# Altium project mgtf.PrjPCB
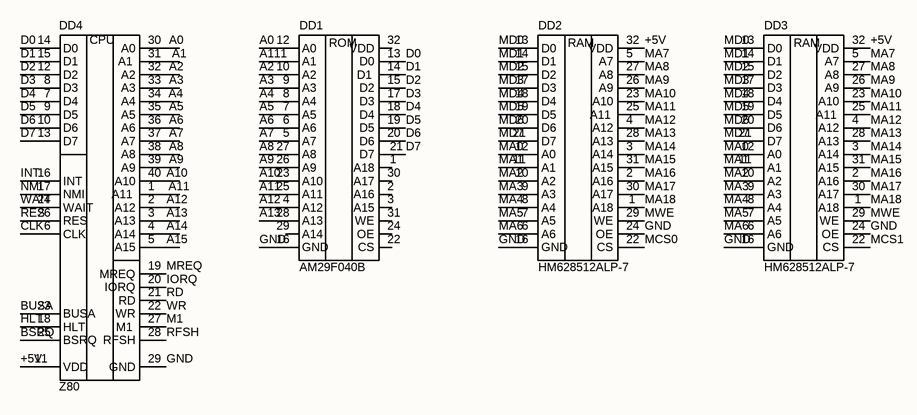
[diagram p0: main.SchDoc]
2 sheets, 10 parts. Net scope: global (net labels, ports and power ports of the same name join across sheets).
Board file: pcb.PcbDoc
Sheets:
  main.SchDoc
  connectors.SchDoc

## Sheet main.SchDoc
size 209 x 297 mm; Address1: Address1; Address2: Address2; Address3: Address3; Address4: Address4; SheetNumber: 1; SheetTotal: 1; Scale: 1:1; Разраб.: Михаил Каа; Обозначение документа: МГТФ.001 Э3; Пров.: no check; Утв.: chat; Номер листа: 1; Общее количество листов: 1; Наименование организации: Михаил Каа; Перв. применение: МГТФ.001; Наименование изделия 1: МГТФ; Наименование изделия 2: Схема электрическая; Наименование изделия 3: принципиальная; Нач. отд.: Нач. отд.; Фамилия нач. отд.: chat

### Parts
DD1  AM29F040B  [DIP254P1524X482-32]
DD2  HM628512ALP-7  [DIP254P1524X482-32]
DD3  HM628512ALP-7  [DIP254P1524X482-32]
DD4  Z80  [DIP1540W47P254L5320H635Q40B]

### Nets
+5V: DD2.32(VDD) DD3.32(VDD) DD4.11(VDD)
A0: DD1.12(A0) DD4.30(A0)
A1: DD1.11(A1) DD4.31(A1)
A2: DD1.10(A2) DD4.32(A2)
A3: DD1.9(A3) DD4.33(A3)
A4: DD1.8(A4) DD4.34(A4)
A5: DD1.7(A5) DD4.35(A5)
A6: DD1.6(A6) DD4.36(A6)
A7: DD1.5(A7) DD4.37(A7)
A8: DD1.27(A8) DD4.38(A8)
A9: DD1.26(A9) DD4.39(A9)
A10: DD1.23(A10) DD4.40(A10)
A11: DD1.25(A11) DD4.1(A11)
A12: DD1.4(A12) DD4.2(A12)
A13: DD1.28(A13) DD4.3(A13)
A14: DD4.4(A14)
A15: DD4.5(A15)
BSRQ: DD4.25(BSRQ)
BUSA: DD4.23(BUSA)
CLK: DD4.6(CLK)
D0: DD1.13(D0) DD4.14(D0)
D1: DD1.14(D1) DD4.15(D1)
D2: DD1.15(D2) DD4.12(D2)
D3: DD1.17(D3) DD4.8(D3)
D4: DD1.18(D4) DD4.7(D4)
D5: DD1.19(D5) DD4.9(D5)
D6: DD1.20(D6) DD4.10(D6)
D7: DD1.21(D7) DD4.13(D7)
GND: DD1.16(GND) DD2.16(GND) DD2.24(OE) DD3.16(GND) DD3.24(OE) DD4.29(GND)
HLT: DD4.18(HLT)
INT: DD4.16(INT)
IORQ: DD4.20(IORQ)
M1: DD4.27(M1)
MA0: DD2.12(A0) DD3.12(A0)
MA1: DD2.11(A1) DD3.11(A1)
MA2: DD2.10(A2) DD3.10(A2)
MA3: DD2.9(A3) DD3.9(A3)
MA4: DD2.8(A4) DD3.8(A4)
MA5: DD2.7(A5) DD3.7(A5)
MA6: DD2.6(A6) DD3.6(A6)
MA7: DD2.5(A7) DD3.5(A7)
MA8: DD2.27(A8) DD3.27(A8)
MA9: DD2.26(A9) DD3.26(A9)
MA10: DD2.23(A10) DD3.23(A10)
MA11: DD2.25(A11) DD3.25(A11)
MA12: DD2.4(A12) DD3.4(A12)
MA13: DD2.28(A13) DD3.28(A13)
MA14: DD2.3(A14) DD3.3(A14)
MA15: DD2.31(A15) DD3.31(A15)
MA16: DD2.2(A16) DD3.2(A16)
MA17: DD2.30(A17) DD3.30(A17)
MA18: DD2.1(A18) DD3.1(A18)
MCS0: DD2.22(CS)
MCS1: DD3.22(CS)
MD0: DD2.13(D0) DD3.13(D0)
MD1: DD2.14(D1) DD3.14(D1)
MD2: DD2.15(D2) DD3.15(D2)
MD3: DD2.17(D3) DD3.17(D3)
MD4: DD2.18(D4) DD3.18(D4)
MD5: DD2.19(D5) DD3.19(D5)
MD6: DD2.20(D6) DD3.20(D6)
MD7: DD2.21(D7) DD3.21(D7)
MREQ: DD4.19(MREQ)
MWE: DD2.29(WE) DD3.29(WE)
NMI: DD4.17(NMI)
RD: DD4.21(RD)
RES: DD4.26(RES)
RFSH: DD4.28(RFSH)
WAIT: DD4.24(WAIT)
WR: DD4.22(WR)

Not connected (* = marked no-connect by the designer): DD1 1(A18) 2(A16) 3(A15) 22(CS) 24(OE) 29(A14) 30(A17) 31(WE) 32(VDD)

### Notes on the sheet
- Перв. примен.
- Справ. №
- Подп. и дата
- Инв. № дубл.
- Взам. инв. №
- Разраб.
- Изм.
- Лист
- № докум.
- Подп.
- Дата
- Лит.
- Масса
- Масштаб
- Пров.
- Т.контр.
- Листов
- Инв. № подл.
- Утв.
- Н.контр.
- Копировал
- Формат А4
- (in symbol AM29F040B) ROM
- (in symbol HM628512ALP-7) RAM
- (in symbol Z80) CPU

### Library data of the parts
DD2 DD3 = HM628512ALP-7: 512Kx8 Static RAM

## Sheet connectors.SchDoc
size 209 x 297 mm; Address1: Address1; Address2: Address2; Address3: Address3; Address4: Address4; SheetNumber: 1; SheetTotal: 1; Scale: 1:1; Разраб.: Михаил Каа; Обозначение документа: МГТФ.001 Э3; Пров.: no check; Утв.: chat; Номер листа: 1; Общее количество листов: 1; Наименование организации: Михаил Каа; Перв. применение: МГТФ.001; Наименование изделия 1: МГТФ; Наименование изделия 2: Схема электрическая; Наименование изделия 3: принципиальная; Нач. отд.: Нач. отд.; Фамилия нач. отд.: chat
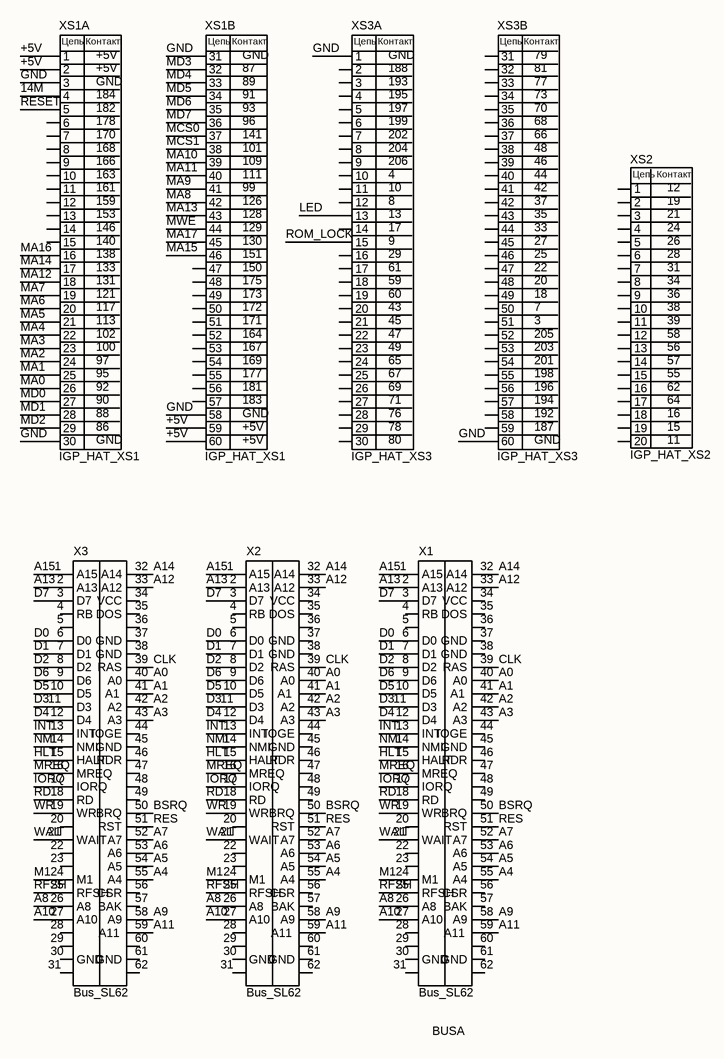
[diagram p1: connectors.SchDoc]

### Parts
X1  Bus_SL62  [SL62]
X2  Bus_SL62  [SL62]
X3  Bus_SL62  [SL62]
XS1  IGP_HAT_XS1  [IGP_HAT_XS_60PIN]  (parts A,B of 2)
XS2  IGP_HAT_XS2  [IGP_HAT_XS_20PIN]
XS3  IGP_HAT_XS3  [IGP_HAT_XS_60PIN]  (parts A,B of 2)

### Nets
14M: XS1.4
+5V: XS1.1 XS1.2 XS1.59 XS1.60
A0: X1.40(A0) X2.40(A0) X3.40(A0)
A1: X1.41(A1) X2.41(A1) X3.41(A1)
A2: X1.42(A2) X2.42(A2) X3.42(A2)
A3: X1.43(A3) X2.43(A3) X3.43(A3)
A4: X1.55(A4) X2.55(A4) X3.55(A4)
A5: X1.54(A5) X2.54(A5) X3.54(A5)
A6: X1.53(A6) X2.53(A6) X3.53(A6)
A7: X1.52(A7) X2.52(A7) X3.52(A7)
A8: X1.26(A8) X2.26(A8) X3.26(A8)
A9: X1.58(A9) X2.58(A9) X3.58(A9)
A10: X1.27(A10) X2.27(A10) X3.27(A10)
A11: X1.59(A11) X2.59(A11) X3.59(A11)
A12: X1.33(A12) X2.33(A12) X3.33(A12)
A13: X1.2(A13) X2.2(A13) X3.2(A13)
A14: X1.32(A14) X2.32(A14) X3.32(A14)
A15: X1.1(A15) X2.1(A15) X3.1(A15)
BSRQ: X1.50(BRQ) X2.50(BRQ) X3.50(BRQ)
CLK: X1.39(RAS) X2.39(RAS) X3.39(RAS)
D0: X1.6(D0) X2.6(D0) X3.6(D0)
D1: X1.7(D1) X2.7(D1) X3.7(D1)
D2: X1.8(D2) X2.8(D2) X3.8(D2)
D3: X1.11(D3) X2.11(D3) X3.11(D3)
D4: X1.12(D4) X2.12(D4) X3.12(D4)
D5: X1.10(D5) X2.10(D5) X3.10(D5)
D6: X1.9(D6) X2.9(D6) X3.9(D6)
D7: X1.3(D7) X2.3(D7) X3.3(D7)
GND: XS1.3 XS1.30 XS1.31 XS1.58 XS3.1 XS3.60
HLT: X1.15(HALT) X2.15(HALT) X3.15(HALT)
INT: X1.13(INT) X2.13(INT) X3.13(INT)
IORQ: X1.17(IORQ) X2.17(IORQ) X3.17(IORQ)
LED: XS3.13
M1: X1.24(M1) X2.24(M1) X3.24(M1)
MA0: XS1.26
MA1: XS1.25
MA2: XS1.24
MA3: XS1.23
MA4: XS1.22
MA5: XS1.21
MA6: XS1.20
MA7: XS1.19
MA8: XS1.42
MA9: XS1.41
MA10: XS1.39
MA11: XS1.40
MA12: XS1.18
MA13: XS1.43
MA14: XS1.17
MA15: XS1.46
MA16: XS1.16
MA17: XS1.45
MCS0: XS1.37
MCS1: XS1.38
MD0: XS1.27
MD1: XS1.28
MD2: XS1.29
MD3: XS1.32
MD4: XS1.33
MD5: XS1.34
MD6: XS1.35
MD7: XS1.36
MREQ: X1.16(MREQ) X2.16(MREQ) X3.16(MREQ)
MWE: XS1.44
NMI: X1.14(NMI) X2.14(NMI) X3.14(NMI)
RD: X1.18(RD) X2.18(RD) X3.18(RD)
RES: X1.51(RST) X2.51(RST) X3.51(RST)
RESET: XS1.5
RFSH: X1.25(RFSH) X2.25(RFSH) X3.25(RFSH)
ROM_LOCK: XS3.15
WAIT: X1.21(WAIT) X2.21(WAIT) X3.21(WAIT)
WR: X1.19(WR) X2.19(WR) X3.19(WR)

Not connected (* = marked no-connect by the designer): X1 4(RB) 5 20 22 23 28 29 30(GND) 31 34(VCC) 35(DOS) 36 37(GND) 38(GND) 44(IOGE) 45(GND) 46(RDR) 47 48 49 56(CSR) 57(BAK) 60 61(GND) 62; X2 4(RB) 5 20 22 23 28 29 30(GND) 31 34(VCC) 35(DOS) 36 37(GND) 38(GND) 44(IOGE) 45(GND) 46(RDR) 47 48 49 56(CSR) 57(BAK) 60 61(GND) 62; X3 4(RB) 5 20 22 23 28 29 30(GND) 31 34(VCC) 35(DOS) 36 37(GND) 38(GND) 44(IOGE) 45(GND) 46(RDR) 47 48 49 56(CSR) 57(BAK) 60 61(GND) 62; XS1 6 7 8 9 10 11 12 13 14 15 47 48 49 50 51 52 53 54 55 56 57; XS2 1 2 3 4 5 6 7 8 9 10 11 12 13 14 15 16 17 18 19 20; XS3 2 3 4 5 6 7 8 9 10 11 12 14 16 17 18 19 20 21 22 23 24 25 26 27 28 29 30 31 32 33 34 35 36 37 38 39 40 41 42 43 44 45 46 47 48 49 50 51 52 53 54 55 56 57 58 59

### Notes on the sheet
- Labels drawn without touching a wire or pin: BUSA
- Подп. и дата
- Инв. № дубл.
- Взам. инв. №
- Инв. № подл.
- Изм.
- Лист
- № докум.
- Подп.
- Дата
- Копировал
- Формат А4
- (in symbol IGP_HAT_XS1, part A) Цепь; Контакт; +5V; GND; 184; 182; 178; 170; 168; 166; 163; 161; 159; 153; 146; 140; 138; 133; 131; 121; 117; 113; 102; 100; 97; 95; 92; 90; 88; 86
- (in symbol IGP_HAT_XS1, part B) Цепь; Контакт; GND; 87; 89; 91; 93; 96; 141; 101; 109; 111; 99; 126; 128; 129; 130; 151; 150; 175; 173; 172; 171; 164; 167; 169; 177; 181; 183; +5V
- (in symbol IGP_HAT_XS2) Цепь; Контакт; 21; 24; 26; 28; 31; 34; 36; 38; 39; 58; 56; 57; 55; 62; 64
- (in symbol IGP_HAT_XS3, part A) Цепь; Контакт; GND; 188; 193; 195; 197; 199; 202; 204; 206; 61; 65; 67; 69; 71; 76; 78; 80
- (in symbol IGP_HAT_XS3, part B) Цепь; Контакт; 79; 81; 77; 73; 70; 68; 66; 205; 203; 201; 198; 196; 194; 192; 187; GND

## Nets that join several sheets
+5V: main (DD2.32 DD3.32 DD4.11), connectors (XS1.1 XS1.2 XS1.59 XS1.60)
A0: main (DD1.12 DD4.30), connectors (X1.40 X2.40 X3.40)
A1: main (DD1.11 DD4.31), connectors (X1.41 X2.41 X3.41)
A2: main (DD1.10 DD4.32), connectors (X1.42 X2.42 X3.42)
A3: main (DD1.9 DD4.33), connectors (X1.43 X2.43 X3.43)
A4: main (DD1.8 DD4.34), connectors (X1.55 X2.55 X3.55)
A5: main (DD1.7 DD4.35), connectors (X1.54 X2.54 X3.54)
A6: main (DD1.6 DD4.36), connectors (X1.53 X2.53 X3.53)
A7: main (DD1.5 DD4.37), connectors (X1.52 X2.52 X3.52)
A8: main (DD1.27 DD4.38), connectors (X1.26 X2.26 X3.26)
A9: main (DD1.26 DD4.39), connectors (X1.58 X2.58 X3.58)
A10: main (DD1.23 DD4.40), connectors (X1.27 X2.27 X3.27)
A11: main (DD1.25 DD4.1), connectors (X1.59 X2.59 X3.59)
A12: main (DD1.4 DD4.2), connectors (X1.33 X2.33 X3.33)
A13: main (DD1.28 DD4.3), connectors (X1.2 X2.2 X3.2)
A14: main (DD4.4), connectors (X1.32 X2.32 X3.32)
A15: main (DD4.5), connectors (X1.1 X2.1 X3.1)
BSRQ: main (DD4.25), connectors (X1.50 X2.50 X3.50)
CLK: main (DD4.6), connectors (X1.39 X2.39 X3.39)
D0: main (DD1.13 DD4.14), connectors (X1.6 X2.6 X3.6)
D1: main (DD1.14 DD4.15), connectors (X1.7 X2.7 X3.7)
D2: main (DD1.15 DD4.12), connectors (X1.8 X2.8 X3.8)
D3: main (DD1.17 DD4.8), connectors (X1.11 X2.11 X3.11)
D4: main (DD1.18 DD4.7), connectors (X1.12 X2.12 X3.12)
D5: main (DD1.19 DD4.9), connectors (X1.10 X2.10 X3.10)
D6: main (DD1.20 DD4.10), connectors (X1.9 X2.9 X3.9)
D7: main (DD1.21 DD4.13), connectors (X1.3 X2.3 X3.3)
GND: main (6 pins), connectors (6 pins)
HLT: main (DD4.18), connectors (X1.15 X2.15 X3.15)
INT: main (DD4.16), connectors (X1.13 X2.13 X3.13)
IORQ: main (DD4.20), connectors (X1.17 X2.17 X3.17)
M1: main (DD4.27), connectors (X1.24 X2.24 X3.24)
MA0: main (DD2.12 DD3.12), connectors (XS1.26)
MA1: main (DD2.11 DD3.11), connectors (XS1.25)
MA2: main (DD2.10 DD3.10), connectors (XS1.24)
MA3: main (DD2.9 DD3.9), connectors (XS1.23)
MA4: main (DD2.8 DD3.8), connectors (XS1.22)
MA5: main (DD2.7 DD3.7), connectors (XS1.21)
MA6: main (DD2.6 DD3.6), connectors (XS1.20)
MA7: main (DD2.5 DD3.5), connectors (XS1.19)
MA8: main (DD2.27 DD3.27), connectors (XS1.42)
MA9: main (DD2.26 DD3.26), connectors (XS1.41)
MA10: main (DD2.23 DD3.23), connectors (XS1.39)
MA11: main (DD2.25 DD3.25), connectors (XS1.40)
MA12: main (DD2.4 DD3.4), connectors (XS1.18)
MA13: main (DD2.28 DD3.28), connectors (XS1.43)
MA14: main (DD2.3 DD3.3), connectors (XS1.17)
MA15: main (DD2.31 DD3.31), connectors (XS1.46)
MA16: main (DD2.2 DD3.2), connectors (XS1.16)
MA17: main (DD2.30 DD3.30), connectors (XS1.45)
MCS0: main (DD2.22), connectors (XS1.37)
MCS1: main (DD3.22), connectors (XS1.38)
MD0: main (DD2.13 DD3.13), connectors (XS1.27)
MD1: main (DD2.14 DD3.14), connectors (XS1.28)
MD2: main (DD2.15 DD3.15), connectors (XS1.29)
MD3: main (DD2.17 DD3.17), connectors (XS1.32)
MD4: main (DD2.18 DD3.18), connectors (XS1.33)
MD5: main (DD2.19 DD3.19), connectors (XS1.34)
MD6: main (DD2.20 DD3.20), connectors (XS1.35)
MD7: main (DD2.21 DD3.21), connectors (XS1.36)
MREQ: main (DD4.19), connectors (X1.16 X2.16 X3.16)
MWE: main (DD2.29 DD3.29), connectors (XS1.44)
NMI: main (DD4.17), connectors (X1.14 X2.14 X3.14)
RD: main (DD4.21), connectors (X1.18 X2.18 X3.18)
RES: main (DD4.26), connectors (X1.51 X2.51 X3.51)
RFSH: main (DD4.28), connectors (X1.25 X2.25 X3.25)
WAIT: main (DD4.24), connectors (X1.21 X2.21 X3.21)
WR: main (DD4.22), connectors (X1.19 X2.19 X3.19)